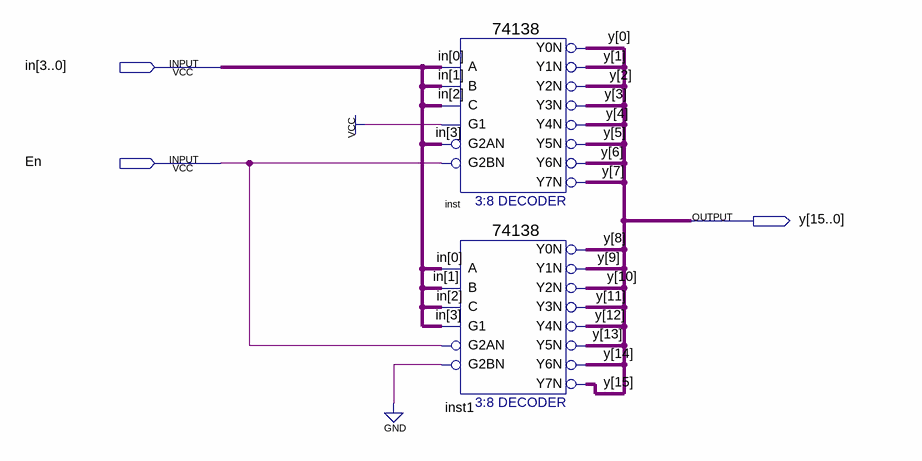
[diagram p0: schematic sheet]
// Quartus schematic Decoder3_8.bdf as structural Verilog: 2 symbols, 3 pins
module Decoder3_8 (
  input  [3:0] in,
  input  En,
  output [15:0] y
);

  \74138  inst (
    .A(in[0]), .B(in[1]), .G1(1'b1), .C(in[2]), .G2AN(in[3]), .G2BN(En), .Y0N(y[0]), .Y1N(y[1]), .Y2N(y[2]),
    .Y3N(y[3]), .Y4N(y[4]), .Y5N(y[5]), .Y6N(y[6]), .Y7N(y[7]));
  \74138  inst1 (
    .A(in[0]), .B(in[1]), .G1(in[3]), .C(in[2]), .G2AN(En), .G2BN(1'b0), .Y0N(y[8]), .Y1N(y[9]), .Y2N(y[10]),
    .Y3N(y[11]), .Y4N(y[12]), .Y5N(y[13]), .Y6N(y[14]), .Y7N(y[15]));
endmodule
